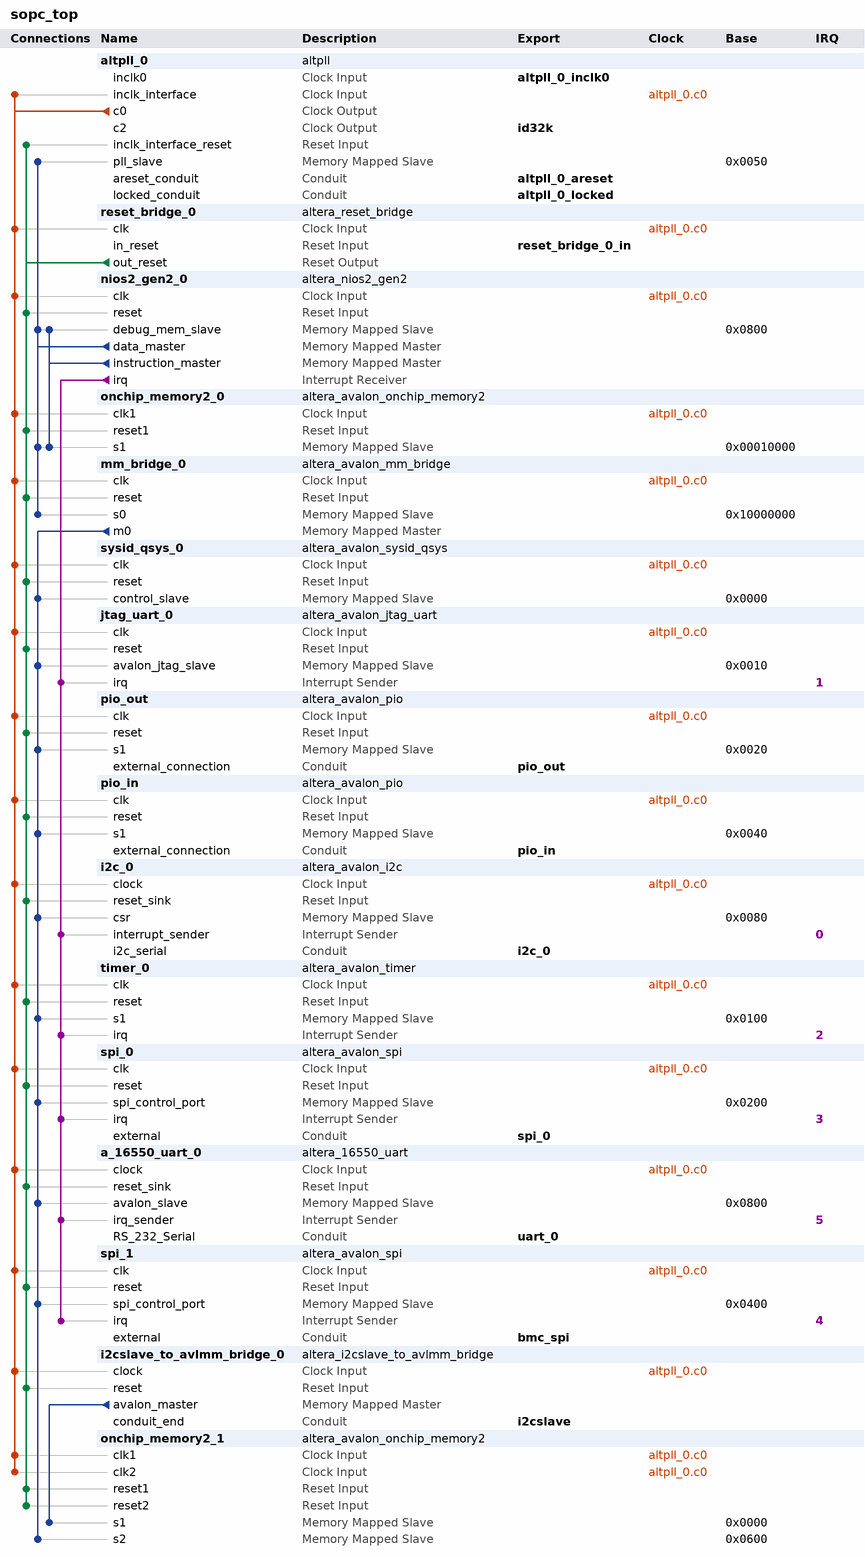
[diagram p0: system contents]
# Platform Designer (Qsys) system sopc_top, Cyclone 10 LP 10CL006YE144C8G
# Parameters at their usual value, and those the tool derives, are not listed.
package require -exact qsys 18.0
create_system sopc_top
set_project_property DEVICE_FAMILY {Cyclone 10 LP}
set_project_property DEVICE 10CL006YE144C8G

add_instance altpll_0 altpll 18.0
set_instance_parameter_value altpll_0 AVALON_USE_SEPARATE_SYSCLK YES
set_instance_parameter_value altpll_0 CLK0_DIVIDE_BY 1
set_instance_parameter_value altpll_0 CLK0_MULTIPLY_BY 4
set_instance_parameter_value altpll_0 CLK1_DIVIDE_BY 5
set_instance_parameter_value altpll_0 CLK1_DUTY_CYCLE 50
set_instance_parameter_value altpll_0 CLK1_MULTIPLY_BY 2
set_instance_parameter_value altpll_0 CLK1_PHASE_SHIFT 0
set_instance_parameter_value altpll_0 CLK2_DIVIDE_BY 12207
set_instance_parameter_value altpll_0 CLK2_DUTY_CYCLE 50
set_instance_parameter_value altpll_0 CLK2_MULTIPLY_BY 16
set_instance_parameter_value altpll_0 CLK2_PHASE_SHIFT 0
set_instance_parameter_value altpll_0 INCLK0_INPUT_FREQUENCY 40000
set_instance_parameter_value altpll_0 PORT_ARESET PORT_USED
set_instance_parameter_value altpll_0 PORT_LOCKED PORT_USED
set_instance_parameter_value altpll_0 PORT_clk1 PORT_USED
set_instance_parameter_value altpll_0 PORT_clk2 PORT_USED
set_instance_parameter_value altpll_0 PORT_clk3 PORT_UNUSED

add_instance reset_bridge_0 altera_reset_bridge 18.0
set_instance_parameter_value reset_bridge_0 ACTIVE_LOW_RESET 1
set_instance_parameter_value reset_bridge_0 SYNCHRONOUS_EDGES deassert

add_instance nios2_gen2_0 altera_nios2_gen2 18.0
set_instance_parameter_value nios2_gen2_0 dcache_size 0
set_instance_parameter_value nios2_gen2_0 exceptionSlave onchip_memory2_0.s1
set_instance_parameter_value nios2_gen2_0 icache_size 512
set_instance_parameter_value nios2_gen2_0 impl Fast
set_instance_parameter_value nios2_gen2_0 resetSlave onchip_memory2_0.s1

add_instance onchip_memory2_0 altera_avalon_onchip_memory2 18.0
set_instance_parameter_value onchip_memory2_0 dataWidth 32
set_instance_parameter_value onchip_memory2_0 dualPort false
set_instance_parameter_value onchip_memory2_0 initMemContent true
set_instance_parameter_value onchip_memory2_0 initializationFileName onchip_mem.hex
set_instance_parameter_value onchip_memory2_0 memorySize 16384

add_instance mm_bridge_0 altera_avalon_mm_bridge 18.0
set_instance_parameter_value mm_bridge_0 ADDRESS_UNITS SYMBOLS
set_instance_parameter_value mm_bridge_0 ADDRESS_WIDTH 10
set_instance_parameter_value mm_bridge_0 DATA_WIDTH 32
set_instance_parameter_value mm_bridge_0 MAX_PENDING_RESPONSES 4
set_instance_parameter_value mm_bridge_0 USE_AUTO_ADDRESS_WIDTH 1

add_instance sysid_qsys_0 altera_avalon_sysid_qsys 18.0
set_instance_parameter_value sysid_qsys_0 id -559035650

add_instance jtag_uart_0 altera_avalon_jtag_uart 18.0
set_instance_parameter_value jtag_uart_0 simInteractiveOptions NO_INTERACTIVE_WINDOWS

add_instance pio_out altera_avalon_pio 18.0
set_instance_parameter_value pio_out bitModifyingOutReg true
set_instance_parameter_value pio_out direction Output
set_instance_parameter_value pio_out width 32

add_instance pio_in altera_avalon_pio 18.0
set_instance_parameter_value pio_in direction Input
set_instance_parameter_value pio_in width 32

add_instance i2c_0 altera_avalon_i2c 18.0
set_instance_parameter_value i2c_0 FIFO_DEPTH 64

add_instance timer_0 altera_avalon_timer 18.0
set_instance_parameter_value timer_0 period 1
set_instance_parameter_value timer_0 periodUnits MSEC

add_instance spi_0 altera_avalon_spi 18.0
set_instance_parameter_value spi_0 clockPhase 1
set_instance_parameter_value spi_0 clockPolarity 0
set_instance_parameter_value spi_0 dataWidth 24
set_instance_parameter_value spi_0 insertSync true
set_instance_parameter_value spi_0 masterSPI true
set_instance_parameter_value spi_0 numberOfSlaves 1
set_instance_parameter_value spi_0 targetClockRate 5000000

add_instance a_16550_uart_0 altera_16550_uart 18.0
set_instance_parameter_value a_16550_uart_0 DMA_EXTRA 0
set_instance_parameter_value a_16550_uart_0 FAMILY {Cyclone 10 LP}
set_instance_parameter_value a_16550_uart_0 FIFO_DEPTH 256
set_instance_parameter_value a_16550_uart_0 FIFO_HWFC 1
set_instance_parameter_value a_16550_uart_0 FIFO_MODE 1
set_instance_parameter_value a_16550_uart_0 FIFO_SWFC 0
set_instance_parameter_value a_16550_uart_0 FIFO_WATERMARK 0
set_instance_parameter_value a_16550_uart_0 MEM_BLOCK_TYPE AUTO

add_instance spi_1 altera_avalon_spi 18.0
set_instance_parameter_value spi_1 clockPolarity 0
set_instance_parameter_value spi_1 dataWidth 8
set_instance_parameter_value spi_1 masterSPI true
set_instance_parameter_value spi_1 numberOfSlaves 1
set_instance_parameter_value spi_1 targetClockRate 128000

add_instance i2cslave_to_avlmm_bridge_0 altera_i2cslave_to_avlmm_bridge 18.0
set_instance_parameter_value i2cslave_to_avlmm_bridge_0 ADDRESS_STEALING 0
set_instance_parameter_value i2cslave_to_avlmm_bridge_0 BYTE_ADDRESSING 1
set_instance_parameter_value i2cslave_to_avlmm_bridge_0 I2C_SLAVE_ADDRESS 32
set_instance_parameter_value i2cslave_to_avlmm_bridge_0 READ_ONLY 0

add_instance onchip_memory2_1 altera_avalon_onchip_memory2 18.0
set_instance_parameter_value onchip_memory2_1 dataWidth 32
set_instance_parameter_value onchip_memory2_1 dualPort true
set_instance_parameter_value onchip_memory2_1 initMemContent true
set_instance_parameter_value onchip_memory2_1 initializationFileName onchip_mem.hex
set_instance_parameter_value onchip_memory2_1 memorySize 256

# connections
add_connection altpll_0.c0 a_16550_uart_0.clock clock
add_connection altpll_0.c0 altpll_0.inclk_interface clock
add_connection altpll_0.c0 i2c_0.clock clock
add_connection altpll_0.c0 i2cslave_to_avlmm_bridge_0.clock clock
add_connection altpll_0.c0 jtag_uart_0.clk clock
add_connection altpll_0.c0 mm_bridge_0.clk clock
add_connection altpll_0.c0 nios2_gen2_0.clk clock
add_connection altpll_0.c0 onchip_memory2_0.clk1 clock
add_connection altpll_0.c0 onchip_memory2_1.clk1 clock
add_connection altpll_0.c0 onchip_memory2_1.clk2 clock
add_connection altpll_0.c0 pio_in.clk clock
add_connection altpll_0.c0 pio_out.clk clock
add_connection altpll_0.c0 reset_bridge_0.clk clock
add_connection altpll_0.c0 spi_0.clk clock
add_connection altpll_0.c0 spi_1.clk clock
add_connection altpll_0.c0 sysid_qsys_0.clk clock
add_connection altpll_0.c0 timer_0.clk clock
add_connection reset_bridge_0.out_reset a_16550_uart_0.reset_sink reset
add_connection reset_bridge_0.out_reset altpll_0.inclk_interface_reset reset
add_connection reset_bridge_0.out_reset i2c_0.reset_sink reset
add_connection reset_bridge_0.out_reset i2cslave_to_avlmm_bridge_0.reset reset
add_connection reset_bridge_0.out_reset jtag_uart_0.reset reset
add_connection reset_bridge_0.out_reset mm_bridge_0.reset reset
add_connection reset_bridge_0.out_reset nios2_gen2_0.reset reset
add_connection reset_bridge_0.out_reset onchip_memory2_0.reset1 reset
add_connection reset_bridge_0.out_reset onchip_memory2_1.reset1 reset
add_connection reset_bridge_0.out_reset onchip_memory2_1.reset2 reset
add_connection reset_bridge_0.out_reset pio_in.reset reset
add_connection reset_bridge_0.out_reset pio_out.reset reset
add_connection reset_bridge_0.out_reset spi_0.reset reset
add_connection reset_bridge_0.out_reset spi_1.reset reset
add_connection reset_bridge_0.out_reset sysid_qsys_0.reset reset
add_connection reset_bridge_0.out_reset timer_0.reset reset
add_connection i2cslave_to_avlmm_bridge_0.avalon_master onchip_memory2_1.s1 avalon
set_connection_parameter_value i2cslave_to_avlmm_bridge_0.avalon_master/onchip_memory2_1.s1 baseAddress 0x0000
add_connection mm_bridge_0.m0 a_16550_uart_0.avalon_slave avalon
set_connection_parameter_value mm_bridge_0.m0/a_16550_uart_0.avalon_slave baseAddress 0x0800
add_connection mm_bridge_0.m0 i2c_0.csr avalon
set_connection_parameter_value mm_bridge_0.m0/i2c_0.csr baseAddress 0x0080
add_connection mm_bridge_0.m0 jtag_uart_0.avalon_jtag_slave avalon
set_connection_parameter_value mm_bridge_0.m0/jtag_uart_0.avalon_jtag_slave baseAddress 0x0010
add_connection mm_bridge_0.m0 onchip_memory2_1.s2 avalon
set_connection_parameter_value mm_bridge_0.m0/onchip_memory2_1.s2 baseAddress 0x0600
add_connection mm_bridge_0.m0 pio_in.s1 avalon
set_connection_parameter_value mm_bridge_0.m0/pio_in.s1 baseAddress 0x0040
add_connection mm_bridge_0.m0 pio_out.s1 avalon
set_connection_parameter_value mm_bridge_0.m0/pio_out.s1 baseAddress 0x0020
add_connection mm_bridge_0.m0 spi_0.spi_control_port avalon
set_connection_parameter_value mm_bridge_0.m0/spi_0.spi_control_port baseAddress 0x0200
add_connection mm_bridge_0.m0 spi_1.spi_control_port avalon
set_connection_parameter_value mm_bridge_0.m0/spi_1.spi_control_port baseAddress 0x0400
add_connection mm_bridge_0.m0 sysid_qsys_0.control_slave avalon
set_connection_parameter_value mm_bridge_0.m0/sysid_qsys_0.control_slave baseAddress 0x0000
add_connection mm_bridge_0.m0 timer_0.s1 avalon
set_connection_parameter_value mm_bridge_0.m0/timer_0.s1 baseAddress 0x0100
add_connection nios2_gen2_0.data_master altpll_0.pll_slave avalon
set_connection_parameter_value nios2_gen2_0.data_master/altpll_0.pll_slave baseAddress 0x0050
add_connection nios2_gen2_0.data_master mm_bridge_0.s0 avalon
set_connection_parameter_value nios2_gen2_0.data_master/mm_bridge_0.s0 baseAddress 0x10000000
add_connection nios2_gen2_0.data_master nios2_gen2_0.debug_mem_slave avalon
set_connection_parameter_value nios2_gen2_0.data_master/nios2_gen2_0.debug_mem_slave baseAddress 0x0800
add_connection nios2_gen2_0.data_master onchip_memory2_0.s1 avalon
set_connection_parameter_value nios2_gen2_0.data_master/onchip_memory2_0.s1 baseAddress 0x00010000
add_connection nios2_gen2_0.instruction_master nios2_gen2_0.debug_mem_slave avalon
set_connection_parameter_value nios2_gen2_0.instruction_master/nios2_gen2_0.debug_mem_slave baseAddress 0x0800
add_connection nios2_gen2_0.instruction_master onchip_memory2_0.s1 avalon
set_connection_parameter_value nios2_gen2_0.instruction_master/onchip_memory2_0.s1 baseAddress 0x00010000
add_connection nios2_gen2_0.irq a_16550_uart_0.irq_sender interrupt
set_connection_parameter_value nios2_gen2_0.irq/a_16550_uart_0.irq_sender irqNumber 5
add_connection nios2_gen2_0.irq i2c_0.interrupt_sender interrupt
set_connection_parameter_value nios2_gen2_0.irq/i2c_0.interrupt_sender irqNumber 0
add_connection nios2_gen2_0.irq jtag_uart_0.irq interrupt
set_connection_parameter_value nios2_gen2_0.irq/jtag_uart_0.irq irqNumber 1
add_connection nios2_gen2_0.irq spi_0.irq interrupt
set_connection_parameter_value nios2_gen2_0.irq/spi_0.irq irqNumber 3
add_connection nios2_gen2_0.irq spi_1.irq interrupt
set_connection_parameter_value nios2_gen2_0.irq/spi_1.irq irqNumber 4
add_connection nios2_gen2_0.irq timer_0.irq interrupt
set_connection_parameter_value nios2_gen2_0.irq/timer_0.irq irqNumber 2

# exported interfaces
add_interface altpll_0_areset conduit end
set_interface_property altpll_0_areset EXPORT_OF altpll_0.areset_conduit
add_interface altpll_0_inclk0 clock sink
set_interface_property altpll_0_inclk0 EXPORT_OF altpll_0.inclk0
add_interface altpll_0_locked conduit end
set_interface_property altpll_0_locked EXPORT_OF altpll_0.locked_conduit
add_interface bmc_spi conduit end
set_interface_property bmc_spi EXPORT_OF spi_1.external
add_interface i2c_0 conduit end
set_interface_property i2c_0 EXPORT_OF i2c_0.i2c_serial
add_interface i2cslave conduit end
set_interface_property i2cslave EXPORT_OF i2cslave_to_avlmm_bridge_0.conduit_end
add_interface id32k clock source
set_interface_property id32k EXPORT_OF altpll_0.c2
add_interface pio_in conduit end
set_interface_property pio_in EXPORT_OF pio_in.external_connection
add_interface pio_out conduit end
set_interface_property pio_out EXPORT_OF pio_out.external_connection
add_interface reset_bridge_0_in reset sink
set_interface_property reset_bridge_0_in EXPORT_OF reset_bridge_0.in_reset
add_interface spi_0 conduit end
set_interface_property spi_0 EXPORT_OF spi_0.external
add_interface uart_0 conduit end
set_interface_property uart_0 EXPORT_OF a_16550_uart_0.RS_232_Serial

set_interconnect_requirement {$system} qsys_mm.clockCrossingAdapter HANDSHAKE
set_interconnect_requirement {$system} qsys_mm.enableEccProtection FALSE
set_interconnect_requirement {$system} qsys_mm.insertDefaultSlave FALSE
set_interconnect_requirement {$system} qsys_mm.maxAdditionalLatency 1

save_system sopc_top.qsys
